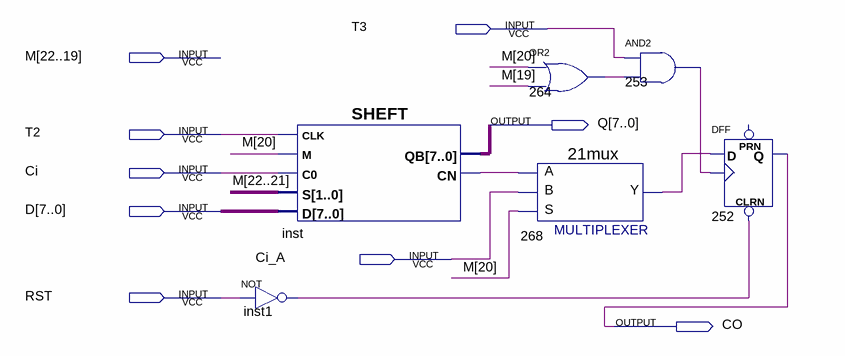
[diagram p0: schematic sheet]
// Quartus schematic SHIFT_1.bdf as structural Verilog: 6 symbols, 9 pins
module SHIFT_1 (
  input  T3,
  input  [22:19] M,
  input  T2,
  input  Ci,
  input  [7:0] D,
  input  Ci_A,
  input  RST,
  output [7:0] Q,
  output CO
);

  wire inst1_out, inst_cn, n253_out, n264_out, n268_y;

  not inst1 (inst1_out, RST);
  SHEFT inst (.CLK(T2), .M(M[20]), .C0(Ci), .S(M[22:21]), .D(D), .QB(Q), .CN(inst_cn));
  or u_264 (n264_out, M[20], M[19]);
  \21mux  u_268 (.A(inst_cn), .B(Ci_A), .S(M[20]), .Y(n268_y));
  and u_253 (n253_out, T3, n264_out);
  DFF u_252 (.CLRN(inst1_out), .CLK(n253_out), .D(n268_y), .Q(CO));  // open: PRN
endmodule
